# EAGLE schematic DumbBadge (EAGLE 9.4.2)

## Sheet 1 of 3: Keyboard Matrix
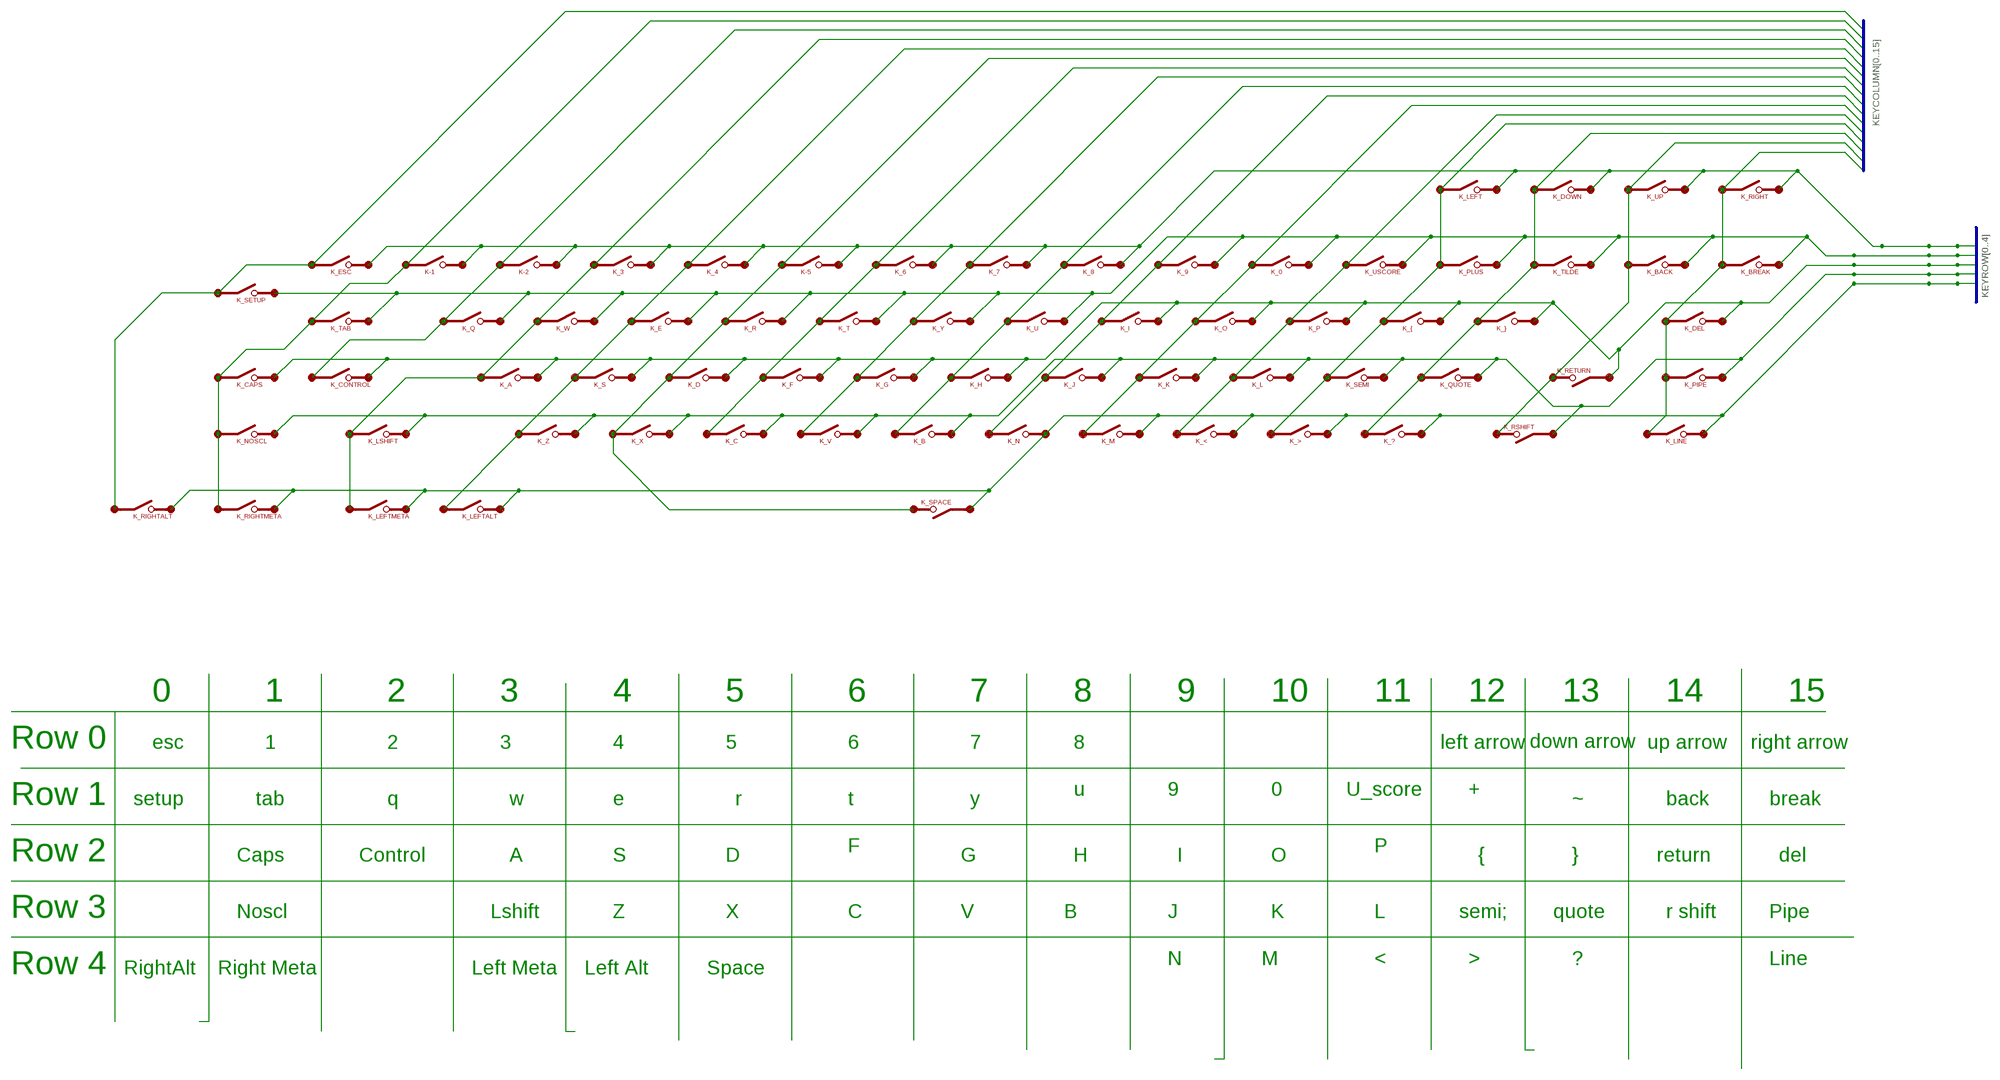
[diagram p0: schematic, sheet 1]

### Parts
K-1  1U_PAD  [SILICONE_SWITCH]
K-2  1U_PAD  [SILICONE_SWITCH]
K-5  1U_PAD  [SILICONE_SWITCH]
K_0  1U_PAD  [SILICONE_SWITCH]
K_3  1U_PAD  [SILICONE_SWITCH]
K_4  1U_PAD  [SILICONE_SWITCH]
K_6  1U_PAD  [SILICONE_SWITCH]
K_7  1U_PAD  [SILICONE_SWITCH]
K_8  1U_PAD  [SILICONE_SWITCH]
K_9  1U_PAD  [SILICONE_SWITCH]
K_<  1U_PAD  [SILICONE_SWITCH]
K_>  1U_PAD  [SILICONE_SWITCH]
K_?  1U_PAD  [SILICONE_SWITCH]
K_A  1U_PAD  [SILICONE_SWITCH]
K_B  1U_PAD  [SILICONE_SWITCH]
K_BACK  1U_PAD  [SILICONE_SWITCH]
K_BREAK  1U_PAD  [SILICONE_SWITCH]
K_C  1U_PAD  [SILICONE_SWITCH]
K_CAPS  1U_PAD  [SILICONE_SWITCH]
K_CONTROL  2U_PAD  [SILICONE_SWITCH_2U]
K_D  1U_PAD  [SILICONE_SWITCH]
K_DEL  1U_PAD  [SILICONE_SWITCH]
K_DOWN  1U_PAD  [SILICONE_SWITCH]
K_E  1U_PAD  [SILICONE_SWITCH]
K_ESC  1U_PAD  [SILICONE_SWITCH]
K_F  1U_PAD  [SILICONE_SWITCH]
K_G  1U_PAD  [SILICONE_SWITCH]
K_H  1U_PAD  [SILICONE_SWITCH]
K_I  1U_PAD  [SILICONE_SWITCH]
K_J  1U_PAD  [SILICONE_SWITCH]
K_K  1U_PAD  [SILICONE_SWITCH]
K_L  1U_PAD  [SILICONE_SWITCH]
K_LEFT  1U_PAD  [SILICONE_SWITCH]
K_LEFTALT  1U_PAD  [SILICONE_SWITCH]
K_LEFTMETA  1U_PAD  [SILICONE_SWITCH]
K_LINE  1U_PAD  [SILICONE_SWITCH]
K_LSHIFT  2U_PAD  [SILICONE_SWITCH_2U]
K_M  1U_PAD  [SILICONE_SWITCH]
K_N  1U_PAD  [SILICONE_SWITCH]
K_NOSCL  1U_PAD  [SILICONE_SWITCH]
K_O  1U_PAD  [SILICONE_SWITCH]
K_P  1U_PAD  [SILICONE_SWITCH]
K_PIPE  1U_PAD  [SILICONE_SWITCH]
K_PLUS  1U_PAD  [SILICONE_SWITCH]
K_Q  1U_PAD  [SILICONE_SWITCH]
K_QUOTE  1U_PAD  [SILICONE_SWITCH]
K_R  1U_PAD  [SILICONE_SWITCH]
K_RETURN  RETURN_PAD  [SILICONE_RETURN]
K_RIGHT  1U_PAD  [SILICONE_SWITCH]
K_RIGHTALT  1U_PAD  [SILICONE_SWITCH]
K_RIGHTMETA  1U_PAD  [SILICONE_SWITCH]
K_RSHIFT  2U_PAD  [SILICONE_SWITCH_2U]
K_S  1U_PAD  [SILICONE_SWITCH]
K_SEMI  1U_PAD  [SILICONE_SWITCH]
K_SETUP  2U_PAD  [SILICONE_SWITCH_2U]
K_SPACE  SPACE_PAD  [SILICONE_SPACE]
K_T  1U_PAD  [SILICONE_SWITCH]
K_TAB  1U_PAD  [SILICONE_SWITCH]
K_TILDE  1U_PAD  [SILICONE_SWITCH]
K_U  1U_PAD  [SILICONE_SWITCH]
K_UP  1U_PAD  [SILICONE_SWITCH]
K_USCORE  1U_PAD  [SILICONE_SWITCH]
K_V  1U_PAD  [SILICONE_SWITCH]
K_W  1U_PAD  [SILICONE_SWITCH]
K_X  1U_PAD  [SILICONE_SWITCH]
K_Y  1U_PAD  [SILICONE_SWITCH]
K_Z  1U_PAD  [SILICONE_SWITCH]
K_{  1U_PAD  [SILICONE_SWITCH]
K_}  1U_PAD  [SILICONE_SWITCH]

### Nets
KEYCOLUMN0: K_ESC.P$2 K_RIGHTALT.P$2 K_SETUP.P$2
KEYCOLUMN1: K-1.P$2 K_CAPS.P$2 K_NOSCL.P$2 K_RIGHTMETA.P$2 K_TAB.P$2
KEYCOLUMN2: K-2.P$2 K_CONTROL.P$2 K_Q.P$2
KEYCOLUMN3: K_3.P$2 K_A.P$2 K_LEFTMETA.P$2 K_LSHIFT.P$2 K_W.P$2
KEYCOLUMN4: K_4.P$2 K_E.P$2 K_LEFTALT.P$2 K_S.P$2 K_Z.P$2
KEYCOLUMN5: K-5.P$2 K_D.P$2 K_R.P$2 K_SPACE.P$1 K_X.P$2
KEYCOLUMN6: K_6.P$2 K_C.P$2 K_F.P$2 K_T.P$2
KEYCOLUMN7: K_7.P$2 K_G.P$2 K_V.P$2 K_Y.P$2
KEYCOLUMN8: K_8.P$2 K_B.P$2 K_H.P$2 K_U.P$2
KEYCOLUMN9: K_9.P$2 K_I.P$2 K_J.P$2 K_N.P$2
KEYCOLUMN10: K_0.P$2 K_K.P$2 K_M.P$2 K_O.P$2
KEYCOLUMN11: K_<.P$2 K_L.P$2 K_P.P$2 K_USCORE.P$2
KEYCOLUMN12: K_>.P$2 K_LEFT.P$2 K_PLUS.P$2 K_SEMI.P$2 K_{.P$2
KEYCOLUMN13: K_?.P$2 K_DOWN.P$2 K_QUOTE.P$2 K_TILDE.P$2 K_}.P$2
KEYCOLUMN14: K_BACK.P$2 K_RETURN.P$1 K_RSHIFT.P$1 K_UP.P$2
KEYCOLUMN15: K_BREAK.P$2 K_DEL.P$2 K_LINE.P$2 K_PIPE.P$2 K_RIGHT.P$2
KEYROW0: K-1.P$1 K-2.P$1 K-5.P$1 K_3.P$1 K_4.P$1 K_6.P$1 K_7.P$1 K_8.P$1 K_DOWN.P$1 K_ESC.P$1 K_LEFT.P$1 K_RIGHT.P$1 K_UP.P$1
KEYROW1: K_0.P$1 K_9.P$1 K_BACK.P$1 K_BREAK.P$1 K_E.P$1 K_PLUS.P$1 K_Q.P$1 K_R.P$1 K_SETUP.P$1 K_T.P$1 K_TAB.P$1 K_TILDE.P$1 K_U.P$1 K_USCORE.P$1 K_W.P$1 K_Y.P$1
KEYROW2: K_A.P$1 K_CAPS.P$1 K_CONTROL.P$1 K_D.P$1 K_DEL.P$1 K_F.P$1 K_G.P$1 K_H.P$1 K_I.P$1 K_O.P$1 K_P.P$1 K_RETURN.P$2 K_S.P$1 K_{.P$1 K_}.P$1
KEYROW3: K_B.P$1 K_C.P$1 K_J.P$1 K_K.P$1 K_L.P$1 K_LSHIFT.P$1 K_NOSCL.P$1 K_PIPE.P$1 K_QUOTE.P$1 K_RSHIFT.P$2 K_SEMI.P$1 K_V.P$1 K_X.P$1 K_Z.P$1
KEYROW4: K_<.P$1 K_>.P$1 K_?.P$1 K_LEFTALT.P$1 K_LEFTMETA.P$1 K_LINE.P$1 K_M.P$1 K_N.P$1 K_RIGHTALT.P$1 K_RIGHTMETA.P$1 K_SPACE.P$2

### Buses
KEYCOLUMN[0..15]
KEYROW[0..4]

### Notes on the sheet
- 0 | 1 | 2 | 3 | 4 | 5 | 6 | 7 | 8 | 9 | 10 | 11 | 12 | 13 | 14 | 15
- Row 0 | esc | 1 | 2 | 3 | 4 | 5 | 6 | 7 | 8 | left arrow | down arrow | up arrow | right arrow
- u | 9 | 0 | U_score | +
- Row 1 | setup | tab | q | w | e | r | t | y | ~ | back | break
- F | P
- Row 2 | Caps | Control | A | S | D | G | H | I | O | { | } | return | del
- Row 3 | Noscl | Lshift | Z | X | C | V | B | J | K | L | semi; | quote | r shift | Pipe
- N | M | < | > | ? | Line
- Row 4 | RightAlt | Right Meta | Left Meta | Left Alt | Space

## Sheet 2 of 3: Microcontroller / Serial
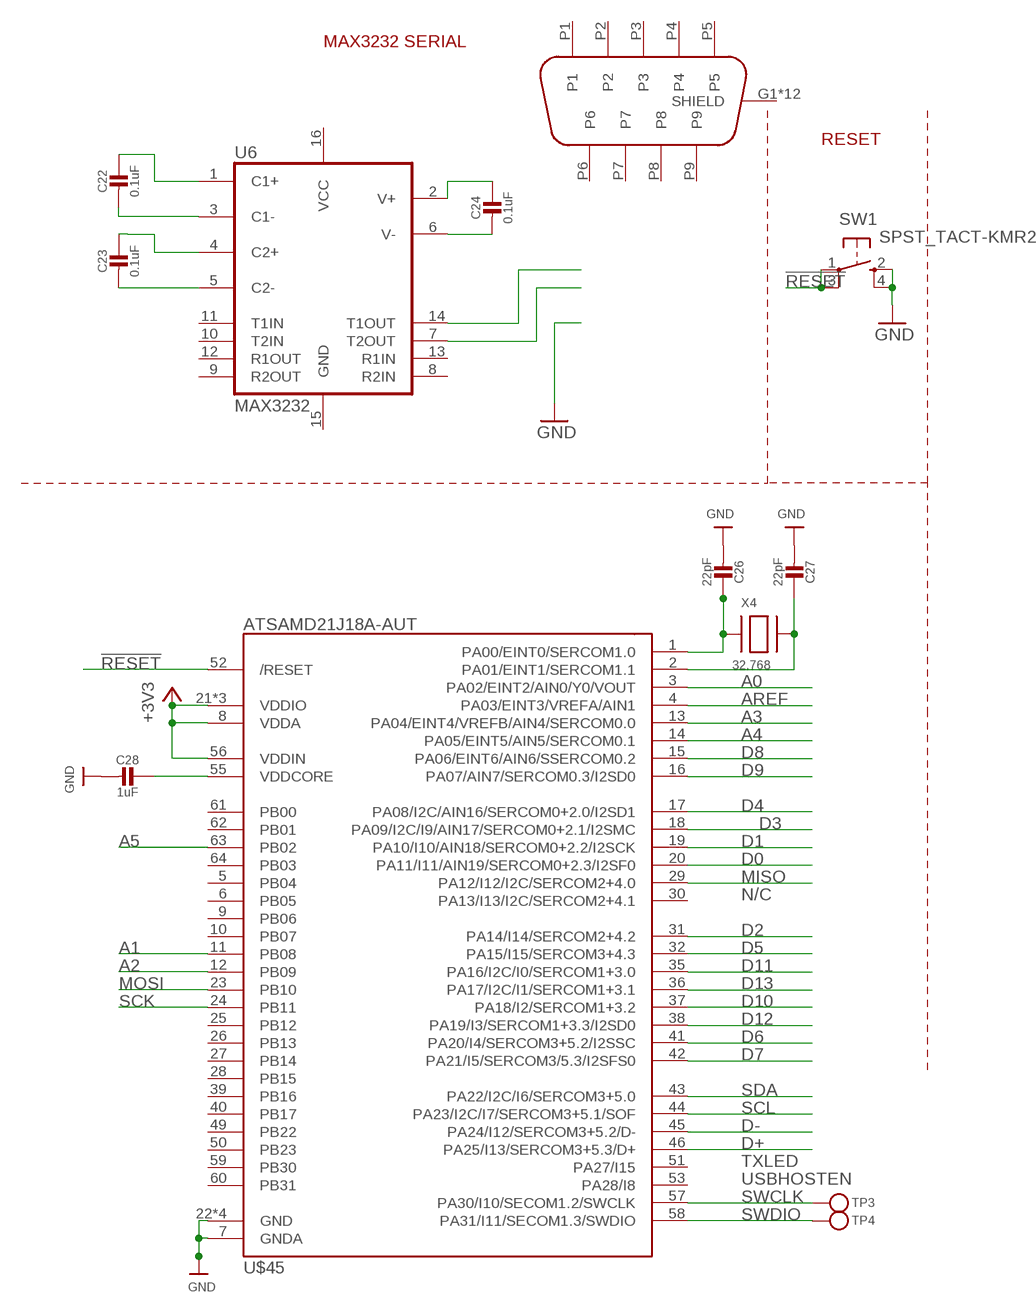
[diagram p1: schematic, sheet 2]

### Parts
C22  0.1uF  CAP_CERAMIC0603_NO  [0603-NO]
C23  0.1uF  CAP_CERAMIC0603_NO  [0603-NO]
C24  0.1uF  CAP_CERAMIC0603_NO  [0603-NO]
C26  22pF  CAP_CERAMIC0603_NO  [0603-NO]
C27  22pF  CAP_CERAMIC0603_NO  [0603-NO]
C28  1uF  CAP_CERAMIC0603_NO  [0603-NO]
SW1  SPST_TACT-KMR2  [KMR2]
TP3  TESTPOINTROUND1.5MM  [TESTPOINT_ROUND_1.5MM]
TP4  TESTPOINTROUND1.5MM  [TESTPOINT_ROUND_1.5MM]
U6  MAX3232  MAX2323SOIC16  [SO16]
U$5  EDGEMOUNTDE9  [DE09S065TLF]
U$45  ATSAMD21J18A-AUT  [TQFP64-10X10]
X4  32.768  XTAL-3.2X1.5  [XTAL3215]

### Nets
!RESET: SW1.1(P) SW1.3(P1) U$45.52(/RESET)
+3V3: U$45.8(VDDA) U$45.21(VDDIO) U$45.34(VDDIO) U$45.48(VDDIO) U$45.56(VDDIN)
A0: U$45.3(PA02/EINT2/AIN0/Y0/VOUT)
A1: U$45.11(PB08)
A2: U$45.12(PB09)
A3: U$45.13(PA04/EINT4/VREFB/AIN4/SERCOM0.0)
A4: U$45.14(PA05/EINT5/AIN5/SERCOM0.1)
A5: U$45.63(PB02)
AREF: U$45.4(PA03/EINT3/VREFA/AIN1)
D0: U$45.20(PA11/I11/AIN19/SERCOM0+2.3/I2SF0)
D1: U$45.19(PA10/I10/AIN18/SERCOM0+2.2/I2SCK)
D2: U$45.31(PA14/I14/SERCOM2+4.2)
D3: U$45.18(PA09/I2C/I9/AIN17/SERCOM0+2.1/I2SMC)
D4: U$45.17(PA08/I2C/AIN16/SERCOM0+2.0/I2SD1)
D5: U$45.32(PA15/I15/SERCOM3+4.3)
D6: U$45.41(PA20/I4/SERCOM3+5.2/I2SSC)
D7: U$45.42(PA21/I5/SERCOM3/5.3/I2SFS0)
D8: U$45.15(PA06/EINT6/AIN6/SSERCOM0.2)
D9: U$45.16(PA07/AIN7/SERCOM0.3/I2SD0)
D10: U$45.37(PA18/I2/SERCOM1+3.2)
D11: U$45.35(PA16/I2C/I0/SERCOM1+3.0)
D12: U$45.38(PA19/I3/SERCOM1+3.3/I2SD0)
D13: U$45.36(PA17/I2C/I1/SERCOM1+3.1)
D+: U$45.46(PA25/I13/SERCOM3+5.3/D+)
D-: U$45.45(PA24/I12/SERCOM3+5.2/D-)
GND: C26.2 C27.2 C28.2 SW1.2(S) SW1.4(S1) U$45.7(GNDA) U$45.22(GND) U$45.33(GND) U$45.47(GND) U$45.54(GND) ; also sheet 3
MISO: U$45.29(PA12/I12/I2C/SERCOM2+4.0)
MOSI: U$45.23(PB10)
N$52: U6.14(T1OUT)
N$53: U6.7(T2OUT)
N$54: C26.1 U$45.1(PA00/EINT0/SERCOM1.0) X4.P$1
N$55: C27.1 U$45.2(PA01/EINT1/SERCOM1.1) X4.P$2
N$56: C22.2 U6.3(C1-)
N$57: C22.1 U6.1(C1+)
N$58: C23.1 U6.4(C2+)
N$59: C23.2 U6.5(C2-)
N$60: C24.1 U6.2(V+)
N$61: C24.2 U6.6(V-)
SCK: U$45.24(PB11)
SCL: U$45.44(PA23/I2C/I7/SERCOM3+5.1/SOF)
SDA: U$45.43(PA22/I2C/I6/SERCOM3+5.0)
SWCLK: TP3.P$1 U$45.57(PA30/I10/SECOM1.2/SWCLK)
SWDIO: TP4.P$1 U$45.58(PA31/I11/SECOM1.3/SWDIO)
VDDCORE2: C28.1 U$45.55(VDDCORE)
Unconnected: U6.8(R2IN) U6.9(R2OUT) U6.10(T2IN) U6.11(T1IN) U6.12(R1OUT) U6.13(R1IN) U6.15(GND) U6.16(VCC) U$5.G1(SHIELD) U$5.G2(SHIELD) U$5.G3(SHIELD) U$5.G4(SHIELD) U$5.G5(SHIELD) U$5.G6(SHIELD) U$5.G7(SHIELD) U$5.G8(SHIELD) U$5.G9(SHIELD) U$5.G10(SHIELD) U$5.G11(SHIELD) U$5.G12(SHIELD) U$5.P1 U$5.P2 U$5.P3 U$5.P4 U$5.P5 U$5.P6 U$5.P7 U$5.P8 U$5.P9 U$45.5(PB04) U$45.6(PB05) U$45.9(PB06) U$45.10(PB07) U$45.25(PB12) U$45.26(PB13) U$45.27(PB14) U$45.28(PB15) U$45.30(PA13/I13/I2C/SERCOM2+4.1) U$45.39(PB16) U$45.40(PB17) U$45.49(PB22) U$45.50(PB23) U$45.51(PA27/I15) U$45.53(PA28/I8) U$45.59(PB30) U$45.60(PB31) U$45.61(PB00) U$45.62(PB01) U$45.64(PB03)

### Notes on the sheet
- MAX3232 SERIAL
- RESET
- N/C
- TXLED
- USBHOSTEN

## Sheet 3 of 3: Power System From RGB Gaming Coaster
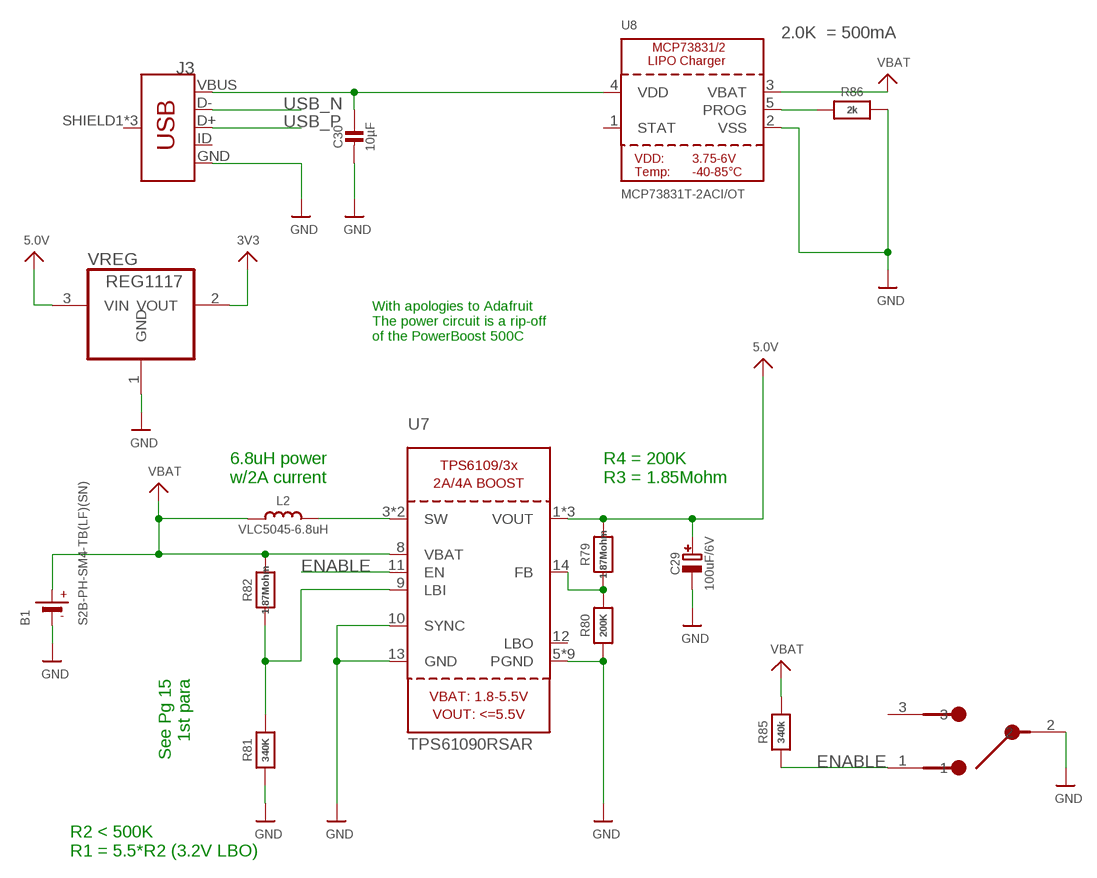
[diagram p2: schematic, sheet 3]

### Parts
B1  S2B-PH-SM4-TB(LF)(SN)  BATTERY  [JSTPH2]
C29  100uF/6V  CAP_TANTALUMB/3528_REFLOW  [EIA3528-21/B-R]
C30  10µF  CAP_CERAMIC0805-NOOUTLINE  [0805-NO]
J3  USB_MICRO-B_FEMALE-SMT  [USB-B-MICRO-SMD]
L2  VLC5045-6.8uH  INDUCTORTDK_VLC5045  [INDUCTOR_5X5MM_TDK_VLC5045]
R79  1.87Mohm  RESISTOR0805_NOOUTLINE  [0805-NO]
R80  200K  RESISTOR0805_NOOUTLINE  [0805-NO]
R81  340K  RESISTOR0805_NOOUTLINE  [0805-NO]
R82  1.87Mohm  RESISTOR0805_NOOUTLINE  [0805-NO]
R85  340k  RESISTOR0805_NOOUTLINE  [0805-NO]
R86  2k  RESISTOR0805_NOOUTLINE  [0805-NO]
U7  TPS61090RSAR  VREG_TPS6103X  [PVQFN-16]
U8  MCP73831T-2ACI/OT  MCP73831/2  [SOT23-5]
U$57  TINDIE_SWITCH  ALPSSLIDESW  [SWITCH-SSSS810701]
VREG  REG1117  [SOT223]

### Nets
3V3: VREG.2(VOUT)
5.0V: C29.+ R79.2 U7.1(VOUT) U7.15(VOUT) U7.16(VOUT) VREG.3(VIN)
ENABLE: R85.1 U7.11(EN) U$57.1
GND: B1.1(-) C29.- C30.2 J3.GND R80.1 R81.1 R86.2 U7.5(PGND) U7.6(PGND) U7.7(PGND) U7.10(SYNC) U7.13(GND) U7.P$18(PGND) U7.P$19(PGND) U7.P$20(PGND) U7.P$21(PGND) U7.P$22(PGND) U7.THERMAL(PGND) U8.2(VSS) U$57.2 VREG.1(GND) ; also sheet 2
N$73: L2.P$2 U7.3(SW) U7.4(SW)
N$74: R81.2 R82.1 U7.9(LBI)
N$76: R79.1 R80.2 U7.14(FB)
N$81: R86.1 U8.5(PROG)
USB_N [diff_pairs]: J3.D-
USB_P [diff_pairs]: J3.D+
VBAT: B1.2(+) L2.P$1 R82.2 R85.2 U7.8(VBAT) U8.3(VBAT)
VDD1: C30.1 J3.VBUS U8.4(VDD)
Unconnected: J3.ID J3.SHIELD1(SHIELD) J3.SHIELD2(SHIELD) J3.SHIELD3(SHIELD) U7.12(LBO) U8.1(STAT) U$57.3

### Notes on the sheet
- 2.0K  = 500mA
- With apologies to Adafruit
  The power circuit is a rip-off
  of the PowerBoost 500C
- 6.8uH power
  w/2A current
- R4 = 200K
  R3 = 1.85Mohm
- See Pg 15
  1st para
- R2 < 500K
  R1 = 5.5*R2 (3.2V LBO)

## Library data of the parts
B1 = microbuilder:BATTERY: CR1220 SMT - Digikey: 3001K-ND CD2032 BAT-HLD-001 - Digikey: BAT-HLD-001-ND
C22-C24 C26-C28 C30 = microbuilder:CAP_CERAMIC: Ceramic Capacitors For new designs, use the packages preceded by an '_' character since they are more reliable: The following footprints should be used on most boards: _0402 - Standard footprint for regular board layouts _0603 - Standard footprint for regular board layouts _0805 - Standard footprint for regular board layouts _1206 - Standard footprint for regular board layouts For extremely tight-pitch boards where space is at a premium, the following 'micro-pitch' footprints can be used (smaller pads, no silkscreen outline, etc.): _0402MP - Micro-pitch footprint for very dense/compact boards _0603MP - Micro-pitch footprint for very dense/compact boards _0805MP - Micro-pitch footprint for very dense/compact boards _1206MP - Micro-pitch footprint for very dense/compact boards
C29 = microbuilder:CAP_TANTALUM: Tantalum Capacitors Wave footprints have larger pads and are meant to be used for hand soldering. Reflow footprints are optimised for solder paste and a reflow oven. EIA3216-18/A-[R/W] - Size A / 3216-18 / 1206 footprint 4.7µF 25V 10% Tantalum Capacitor 10µF 16V 10% Tantalum Capacitor [Digikey: 495-2236-2-ND] EIA3528-21/B-[R/W] - Size B / 3528-21 47µF 10V 10% Tantalum Capactior [Digikey: 495-2216-1-ND] EIA6032-28/C-[R/W] - Size C / 6032-28 10µF 35V 20% Tantalum Capacitor [Digikey: 495-2285-1-ND] 100µF 16V 10% Tantalum Capactior [Digikey: 399-5214-1-ND]
J3 = SparkFun-Connectors:USB_MICRO-B: USB Type Micro-B Connector Male/female and PTH/SMT variants SparkFun Products: SparkFun microB USB Breakout <https://www.sparkfun.com/products/12035> SparkFun USB microB Plug Breakout <https://www.sparkfun.com/products/10031> SparkFun ESP8266 Thing <https://www.sparkfun.com/products/13231>; PROD_ID: CONN-11752
K-1 K-2 K-5 K_0 K_3 K_4 K_6-K_9 K_< K_> K_? K_A K_B K_BACK K_BREAK K_C K_CAPS K_D K_DEL K_DOWN K_E K_ESC K_F K_G K_H K_I K_J K_K K_L K_LEFT K_LEFTALT K_LEFTMETA K_LINE K_M K_N K_NOSCL K_O K_P K_PIPE K_PLUS K_Q K_QUOTE K_R K_RIGHT K_RIGHTALT K_RIGHTMETA K_S K_SEMI K_T K_TAB K_TILDE K_U K_UP K_USCORE K_V K_W K_X K_Y K_Z K_{ K_} = SiliconeSwitches:1U_PAD
K_CONTROL K_LSHIFT K_RSHIFT K_SETUP = SiliconeSwitches:2U_PAD
K_RETURN = SiliconeSwitches:RETURN_PAD
K_SPACE = SiliconeSwitches:SPACE_PAD
L2 = microbuilder:INDUCTOR: Inductors 0603: 10nH Ceramic Inductor - microwire antenna/RF (Digikey: 712-1434-2-ND) 0805: 560nH Ceramic Inductor - RF (Digikey: 553-1047-1-ND) 270nH Ceramic Inductor - Q = 40@250MHz, +-5%, 1 Ohm DC Resistance (Digikey: 535-10506-2-ND) 1007 (2518 Metric) SMT: 10µH 10% 250mOhm 820mA 1007 Inductor (Digikey: 587-2189-1-ND) 22µH 10% 500mOhm 580mA 1007 Inductor (Digikey: 587-2190-1-ND) 47µH 10% 950mOhm 420mA 1007 Inductor (Digikey: 587-2191-1-ND) 47µH 5% 100mOhm 1A 1008 Inductor (Digikey: 732-1816-1-ND) 5.0x5.0mm (Taiyo Yuden NR5040 Series) 6.8µH 20% 2.3A 64mOhm Inductor (Digikey: 587-2374-2-ND) 5.0x5.0mm (TDK VLC5045 Series) 4.7µH 20% 3.3A 34mOhm Inductor (Digikey: 445-6526-1-ND) 6.8µH 20% 2.7A 46mOhm Inductor (Digikey: 445-6527-1-ND) 6.0x6.0mm (TDK VLC6045 Series) 4.7µH 20% 3.8A 27mOhm Inductor (Digikey: 445-6538-2-ND) 6.8µH 20% 3A 41mOhm Inductor (Digikey: 445-6540-1-ND) 6.2µH 30% 2.2A 45mOhm Inductor (Digikey: SRR5028-6R2YCT-ND) - Not TDK VLC6045 but footprint should match 6.0x6.0mm (TDK SLF6045 Series) 6.8uH 30% 2A 33mOhm Inductor (Digikey: 445-4572-1-ND, Mouser: 810-SLF645T6R8N2R0PF) 6.0x6.0mm (Sumida CDRH5D28 Series) 6.2uH 30% 1.8A 45mOhm Inductor (Digikey: 308-1542-1-ND) Taiyo Yuden NR3015T2R2M - 2.2uH 20% 1.5A (Digikey: 587-1648-2-ND, Mouser: 963-NR3015T2R2M) - Used with TI TPS62172 CoilCraft RFID Transponder Coil - MA5532-AE (For use with AS3935 Lightning Sensor)
R79-R82 R85 R86 = microbuilder:RESISTOR: Resistors For new designs, use the packages preceded by an '_' character since they are more reliable: The following footprints should be used on most boards: _0402 - Standard footprint for regular board layouts _0603 - Standard footprint for regular board layouts _0805 - Standard footprint for regular board layouts _1206 - Standard footprint for regular board layouts For extremely tight-pitch boards where space is at a premium, the following 'micro-pitch' footprints can be used (smaller pads, no silkscreen outline, etc.): _0402MP - Micro-pitch footprint for very dense/compact boards _0603MP - Micro-pitch footprint for very dense/compact boards _0805MP - Micro-pitch footprint for very dense/compact boards _1206MP - Micro-pitch footprint for very dense/compact boards
SW1 = adafruit:SPST_TACT: SMT 6mm switch, EVQQ2 series http://www.ladyada.net/library/eagle
TP3 TP4 = microbuilder:TESTPOINT: Test Point Various test points for characterisation and PCB testing TESTPOINT_SMT - Compact Surface Mount Test Point [Digikey: 5016KTR-ND]
U6 = SparkFun-IC-Comms:MAX2323: RS232 Transceiver This part covers 232 drivers that are compatible with the MAX3232. Sipex SP3232EB Datasheet <http://cdn.sparkfun.com/datasheets/Components/General%20IC/SP3232EBCA-L.pdf> SparkFun Products SOIC component <https://www.sparkfun.com/products/589> (COM-00589 / IC-08171) Retired DIP component (COM-00316 / IC-08446) SparkFun Transceiver Breakout - MAX3232 <https://www.sparkfun.com/products/11189> (BOB-11189) SparkFun XBee Explorer Serial <https://www.sparkfun.com/products/13225> (WRL-13225); PROD_ID: IC-08171
U7 = microbuilder:VREG_TPS6103X: TPS6103x 4A Boost - 1.8-5.5V Input, Adjustable Output to 5.5V
U8 = microbuilder:MCP73831/2: MCP73831/2 LIPO Charger VDD: 3.75 - 6V Temp -40 - 85°C Programmable Charge Rate: 15-500mA NOTE: STAT is a tri-state logic output on the MCP73831 and an open-drain output on the MCP73832. SOT23-5 with 4.2V output and tri-state logic on STAT = MCP73831T-2ACI/OT
U$5 = Serial:EDGEMOUNTDE9
U$45 = ATSam21:ATSAMD21J18A-AUT
U$57 = TindieBadge:ALPSSLIDESW
VREG = burr-brown:REG1117: 800mA and 1A Low Dropout (LDO) Positive Regulator 1.8V, 2.5V, 2.85V, 3.3V, 5V, and Adj; MPN: REG1117; OC_FARNELL: 1097566; OC_NEWARK: 14P6981
X4 = adafruit2:XTAL: Low cost SMT crystals, no capacitors included http://www.ladyada.net/library/eagle

## Net classes
0 default: width 0.076 mm, drill 0.076 mm, clearance 0.076 mm
1 diff_pairs: width 0.254 mm, clearance 0.102 mm